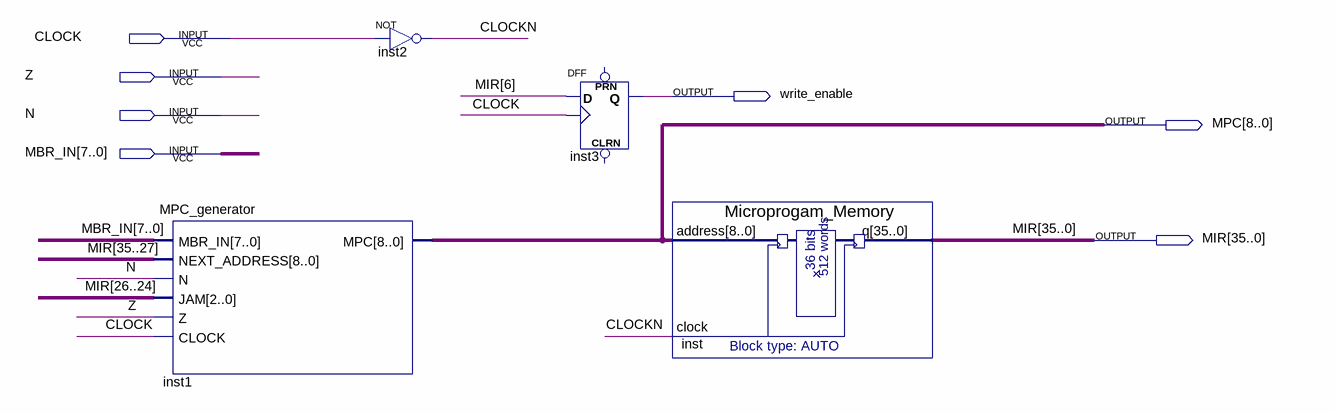
[diagram p0: schematic sheet]
// Quartus schematic UNIT_CONTROL.bdf as structural Verilog: 4 symbols, 7 pins
module UNIT_CONTROL (
  input  CLOCK,
  input  Z,
  input  N,
  input  [7:0] MBR_IN,
  output write_enable,
  output [8:0] MPC,
  output [35:0] MIR
);

  wire CLOCKN;

  MPC_generator inst1 (
    .MBR_IN(MBR_IN), .NEXT_ADDRESS(MIR[35:27]), .N(N), .JAM(MIR[26:24]), .Z(Z), .CLOCK(CLOCK), .MPC(MPC));
  not inst2 (CLOCKN, CLOCK);
  DFF inst3 (.CLK(CLOCK), .D(MIR[6]), .Q(write_enable));  // open: CLRN, PRN
  Microprogam_Memory inst (.address(MPC), .clock(CLOCKN), .q(MIR));
endmodule
